# EAGLE design master_control_shield_v1 (EAGLE 5.11)
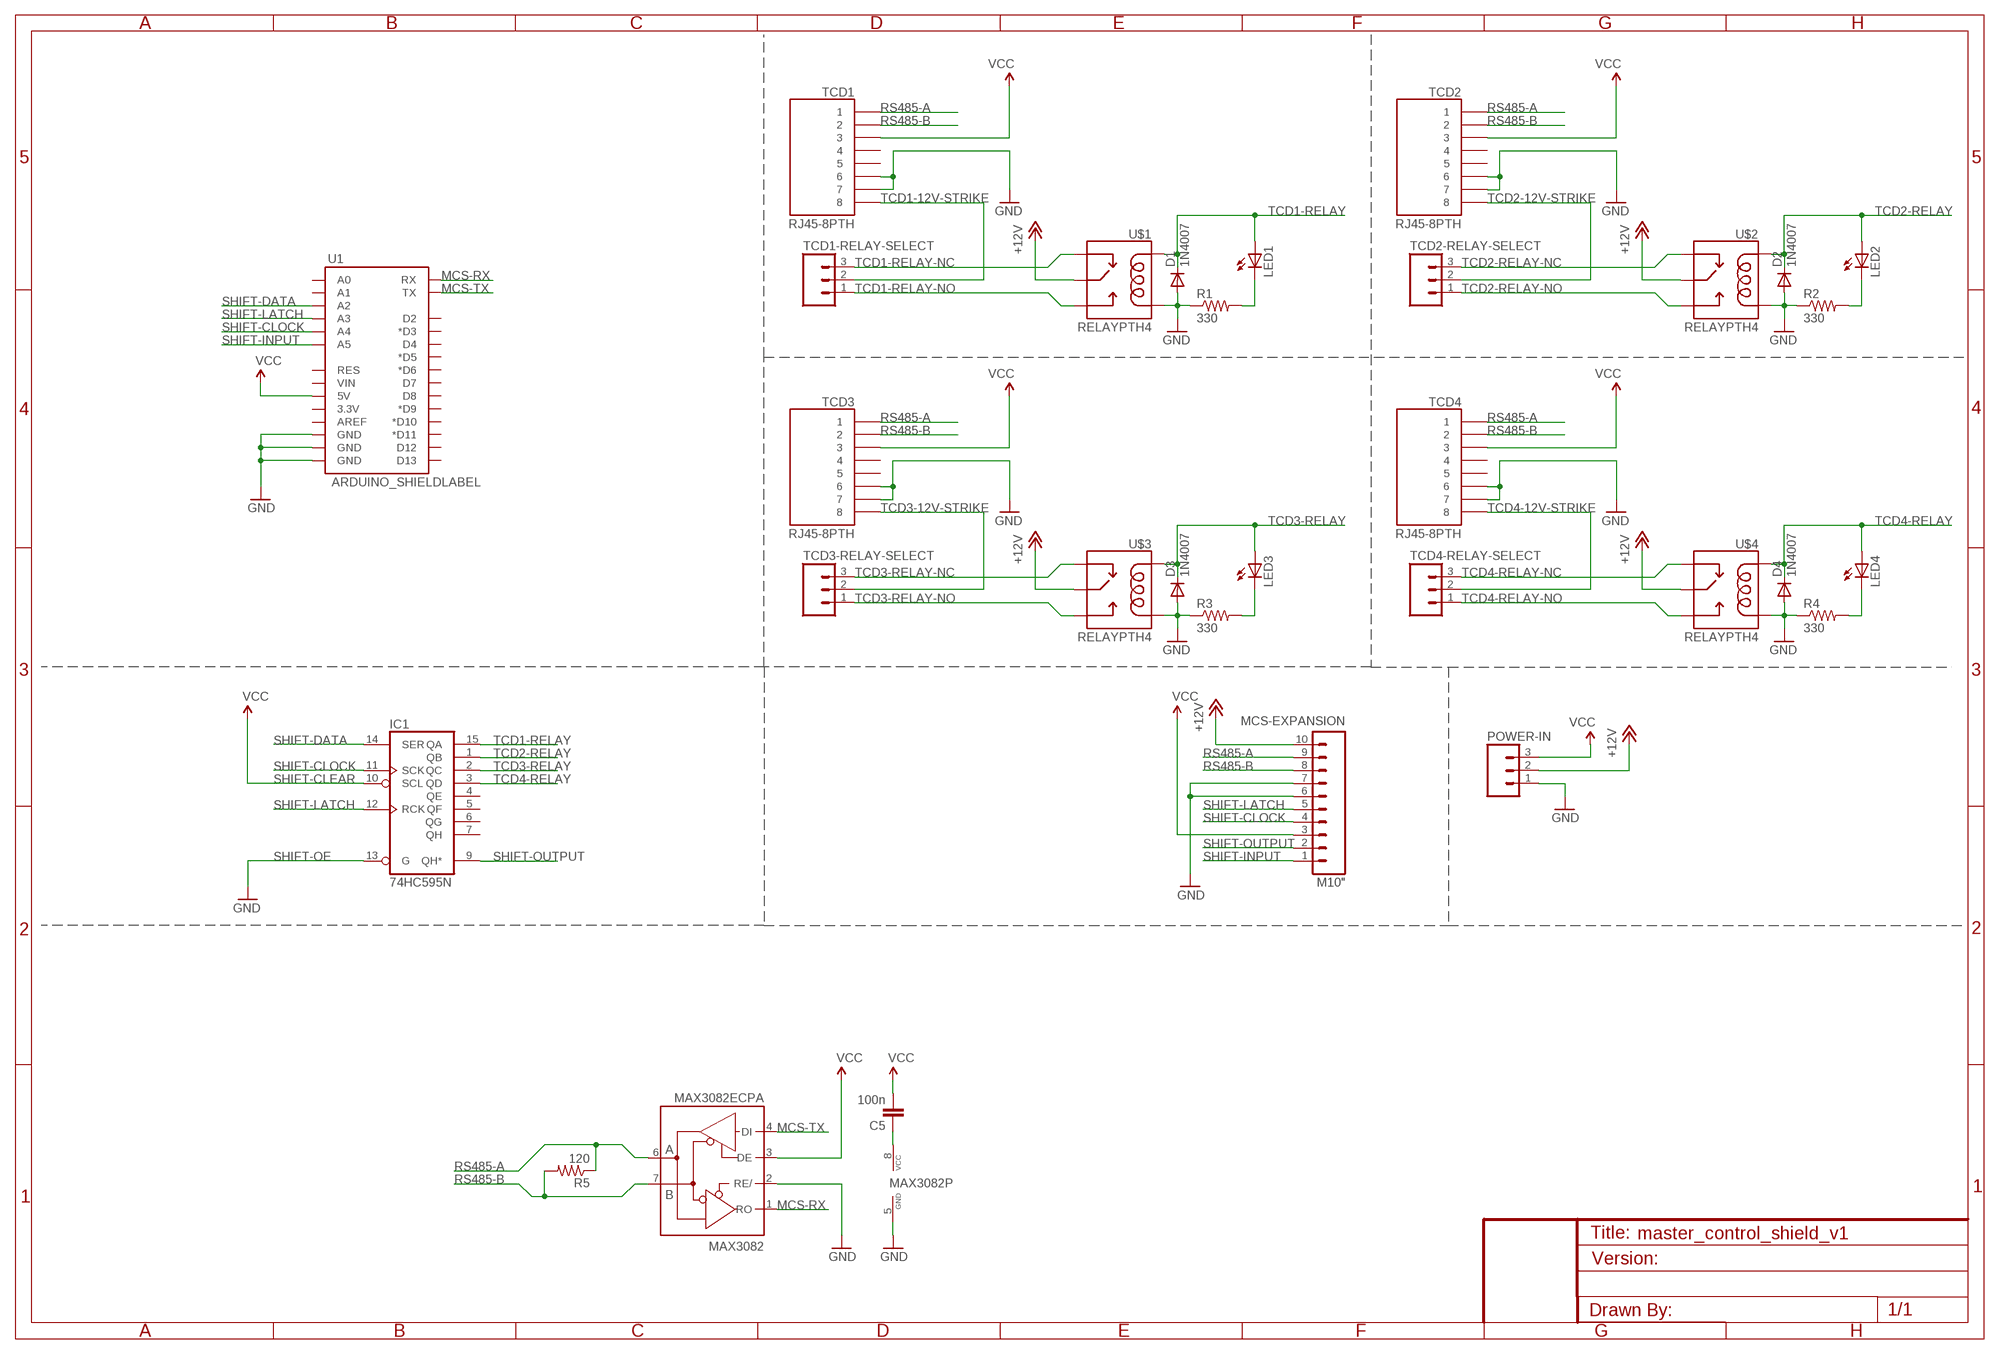
[diagram p0: schematic, sheet 1]

## Parts
C5  100n  CAPPTH  [CAP-PTH-SMALL]
D1  1N4007  DIODEPTH  [DIODE-1N4001]
D2  1N4007  DIODEPTH  [DIODE-1N4001]
D3  1N4007  DIODEPTH  [DIODE-1N4001]
D4  1N4007  DIODEPTH  [DIODE-1N4001]
IC1  74HC595N  74LS595N  [DIL16]
LED1  LED5MM  [LED5MM]
LED2  LED5MM  [LED5MM]
LED3  LED5MM  [LED5MM]
LED4  LED5MM  [LED5MM]
MAX3082  MAX3082ECPA  MAX481CPA  [DIL08]
MCS-EXPANSION  M10"  [1X10]
POWER-IN  M03SCREW  [SCREWTERMINAL-3.5MM-3]
R1  330  RESISTORPTH-1/4W  [AXIAL-0.4]
R2  330  RESISTORPTH-1/4W  [AXIAL-0.4]
R3  330  RESISTORPTH-1/4W  [AXIAL-0.4]
R4  330  RESISTORPTH-1/4W  [AXIAL-0.4]
R5  120  RESISTORPTH-1/4W  [AXIAL-0.4]
TCD1  RJ45-8PTH  [RJ45-8]
TCD1-RELAY-SELECT  M03PTH  [1X03]
TCD2  RJ45-8PTH  [RJ45-8]
TCD2-RELAY-SELECT  M03PTH  [1X03]
TCD3  RJ45-8PTH  [RJ45-8]
TCD3-RELAY-SELECT  M03PTH  [1X03]
TCD4  RJ45-8PTH  [RJ45-8]
TCD4-RELAY-SELECT  M03PTH  [1X03]
U1  ARDUINO_SHIELDLABEL  [DUEMILANOVE_SHIELD]
U$1  RELAYPTH4  [RELAY-JZC]
U$2  RELAYPTH4  [RELAY-JZC]
U$3  RELAYPTH4  [RELAY-JZC]
U$4  RELAYPTH4  [RELAY-JZC]

## Nets
+12V [signal]: MCS-EXPANSION.10 POWER-IN.2 U$1.4(MAIN) U$2.4(MAIN) U$3.4(MAIN) U$4.4(MAIN)
GND: D1.A D2.A D3.A D4.A IC1.13(G) MAX3082.2(RE/) MAX3082.5(GND) MCS-EXPANSION.6 MCS-EXPANSION.7 POWER-IN.1 R1.P$1 R2.P$1 R3.P$1 R4.P$1 TCD1.6 TCD1.7 TCD2.6 TCD2.7 TCD3.6 TCD3.7 TCD4.6 TCD4.7 U1.GND@0(GND) U1.GND@1(GND) U1.GND@2(GND) U$1.1(COIL2) U$2.1(COIL2) U$3.1(COIL2) U$4.1(COIL2)
MCS-RX: MAX3082.1(RO) U1.RX
MCS-TX: MAX3082.4(DI) U1.TX
N$1: LED1.K(C) R1.P$2
N$2: LED2.K(C) R2.P$2
N$3: LED3.K(C) R3.P$2
N$4: LED4.K(C) R4.P$2
N$14: C5.1 MAX3082.8(VCC)
RS485-A: MAX3082.6(A) MCS-EXPANSION.9 R5.P$1 TCD1.1 TCD2.1 TCD3.1 TCD4.1
RS485-B: MAX3082.7(B) MCS-EXPANSION.8 R5.P$2 TCD1.2 TCD2.2 TCD3.2 TCD4.2
SHIFT-CLOCK: IC1.11(SCK) MCS-EXPANSION.4 U1.A4
SHIFT-DATA: IC1.14(SER) U1.A2
SHIFT-INPUT: MCS-EXPANSION.1 U1.A5
SHIFT-LATCH: IC1.12(RCK) MCS-EXPANSION.5 U1.A3
SHIFT-OUTPUT: IC1.9(QH*) MCS-EXPANSION.2
TCD1-12V-STRIKE: TCD1-RELAY-SELECT.2 TCD1.8
TCD1-RELAY: D1.C IC1.15(QA) LED1.A U$1.5(COIL1)
TCD1-RELAY-NC: TCD1-RELAY-SELECT.3 U$1.2(NC)
TCD1-RELAY-NO: TCD1-RELAY-SELECT.1 U$1.3(NO)
TCD2-12V-STRIKE: TCD2-RELAY-SELECT.2 TCD2.8
TCD2-RELAY: D2.C IC1.1(QB) LED2.A U$2.5(COIL1)
TCD2-RELAY-NC: TCD2-RELAY-SELECT.3 U$2.2(NC)
TCD2-RELAY-NO: TCD2-RELAY-SELECT.1 U$2.3(NO)
TCD3-12V-STRIKE: TCD3-RELAY-SELECT.2 TCD3.8
TCD3-RELAY: D3.C IC1.2(QC) LED3.A U$3.5(COIL1)
TCD3-RELAY-NC: TCD3-RELAY-SELECT.3 U$3.2(NC)
TCD3-RELAY-NO: TCD3-RELAY-SELECT.1 U$3.3(NO)
TCD4-12V-STRIKE: TCD4-RELAY-SELECT.2 TCD4.8
TCD4-RELAY: D4.C IC1.3(QD) LED4.A U$4.5(COIL1)
TCD4-RELAY-NC: TCD4-RELAY-SELECT.3 U$4.2(NC)
TCD4-RELAY-NO: TCD4-RELAY-SELECT.1 U$4.3(NO)
VCC: C5.2 IC1.10(SCL) MAX3082.3(DE) MCS-EXPANSION.3 POWER-IN.3 TCD1.3 TCD2.3 TCD3.3 TCD4.3 U1.5V
Unconnected: IC1.4(QE) IC1.5(QF) IC1.6(QG) IC1.7(QH) TCD1.4 TCD1.5 TCD2.4 TCD2.5 TCD3.4 TCD3.5 TCD4.4 TCD4.5 U1.3.3V U1.A0 U1.A1 U1.AREF U1.D2 U1.D3(*D3) U1.D4 U1.D5(*D5) U1.D6(*D6) U1.D7 U1.D8 U1.D9(*D9) U1.D10(*D10) U1.D11(*D11) U1.D12 U1.D13 U1.RES U1.VIN

## Notes on the sheet
- SHIFT-CLEAR
- SHIFT-OE

## Power pins joined to a net without a drawn wire
GND: IC1.8(GND)
VCC: IC1.16(VCC)

## Library data of the parts
C5 = SparkFun:CAP: Capacitor Standard 0603 ceramic capacitor, and 0.1" leaded capacitor.
D1-D4 = SparkFun:DIODE: Diode These are standard reverse protection diodes and small signal diodes. SMA package can handle up to about 1A. SOD-323 can handle about 200mA. What the SOD-323 package when ordering, there are some mfgs out there that are 5-pin packages.
IC1 = 74xx-us:74*595: 8-bit SHIFT REGISTER, output latch
LED1-LED4 = SparkFun:LED: LEDs Standard schematic elements and footprints for 5mm, 3mm, 1206, and 0603 sized LEDs. 5mm - Spark Fun Electronics SKU : COM-00529 (and others)
MAX3082 = maxim:MAX481CPA: RS485 TRANSEIVER; MPN: MAX481CPA+; OC_FARNELL: unknown; OC_NEWARK: 99K3445
MCS-EXPANSION = SparkFun:M10: Header 10 Standard 10-pin 0.1" header. Use with straight break away headers (SKU : PRT-00116), right angle break away headers (PRT-00553), swiss pins (PRT-00743), machine pins (PRT-00117), and female headers (PRT-00115).
POWER-IN TCD1-RELAY-SELECT TCD2-RELAY-SELECT TCD3-RELAY-SELECT TCD4-RELAY-SELECT = SparkFun:M03: Header 3 Standard 3-pin 0.1" header. Use with straight break away headers (SKU : PRT-00116), right angle break away headers (PRT-00553), swiss pins (PRT-00743), machine pins (PRT-00117), and female headers (PRT-00115). Molex polarized connector foot print use with SKU : PRT-08232 with associated crimp pins and housings.
R1-R5 = SparkFun:RESISTOR: Resistor Basic schematic elements and footprints for 0603, 1206, and PTH resistors.
TCD1-TCD4 = SparkFun:RJ45-8: RJ45 Jack Simple RJ45, 8-pin connection - connector for common Cat5, Cat5e, and Cat6 Ethernet cables. Footprint not yet proven in production. Connector sku is PRT-00643; Breakout PCB sku is BOB-00716.
U1 = SparkFun:ARDUINO_SHIELD
U$1-U$4 = SparkFun:RELAY

## Net classes
1 power: width 0.61 mm, clearance 0.406 mm
2 signal: width 0.406 mm, clearance 0.305 mm
3 ground: width 0.406 mm, drill 0.127 mm, clearance 0.254 mm to class 0, clearance 0.254 mm to class 1, clearance 0.254 mm to class 2

## Board
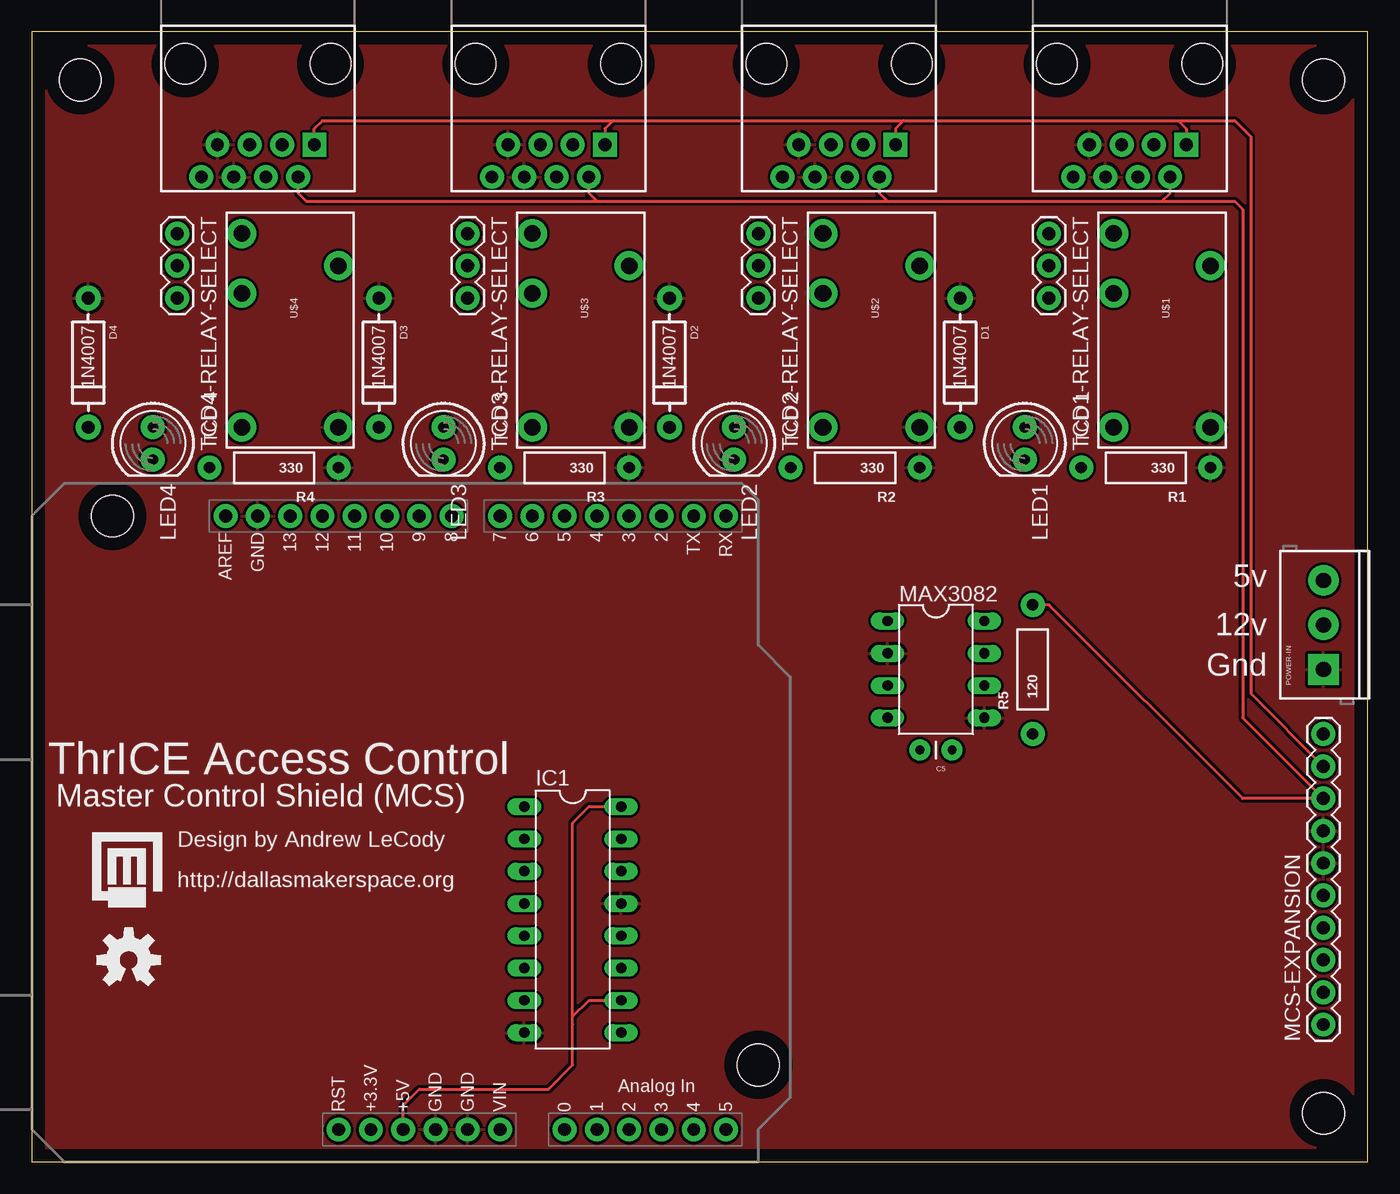
[diagram p1: board, top side]
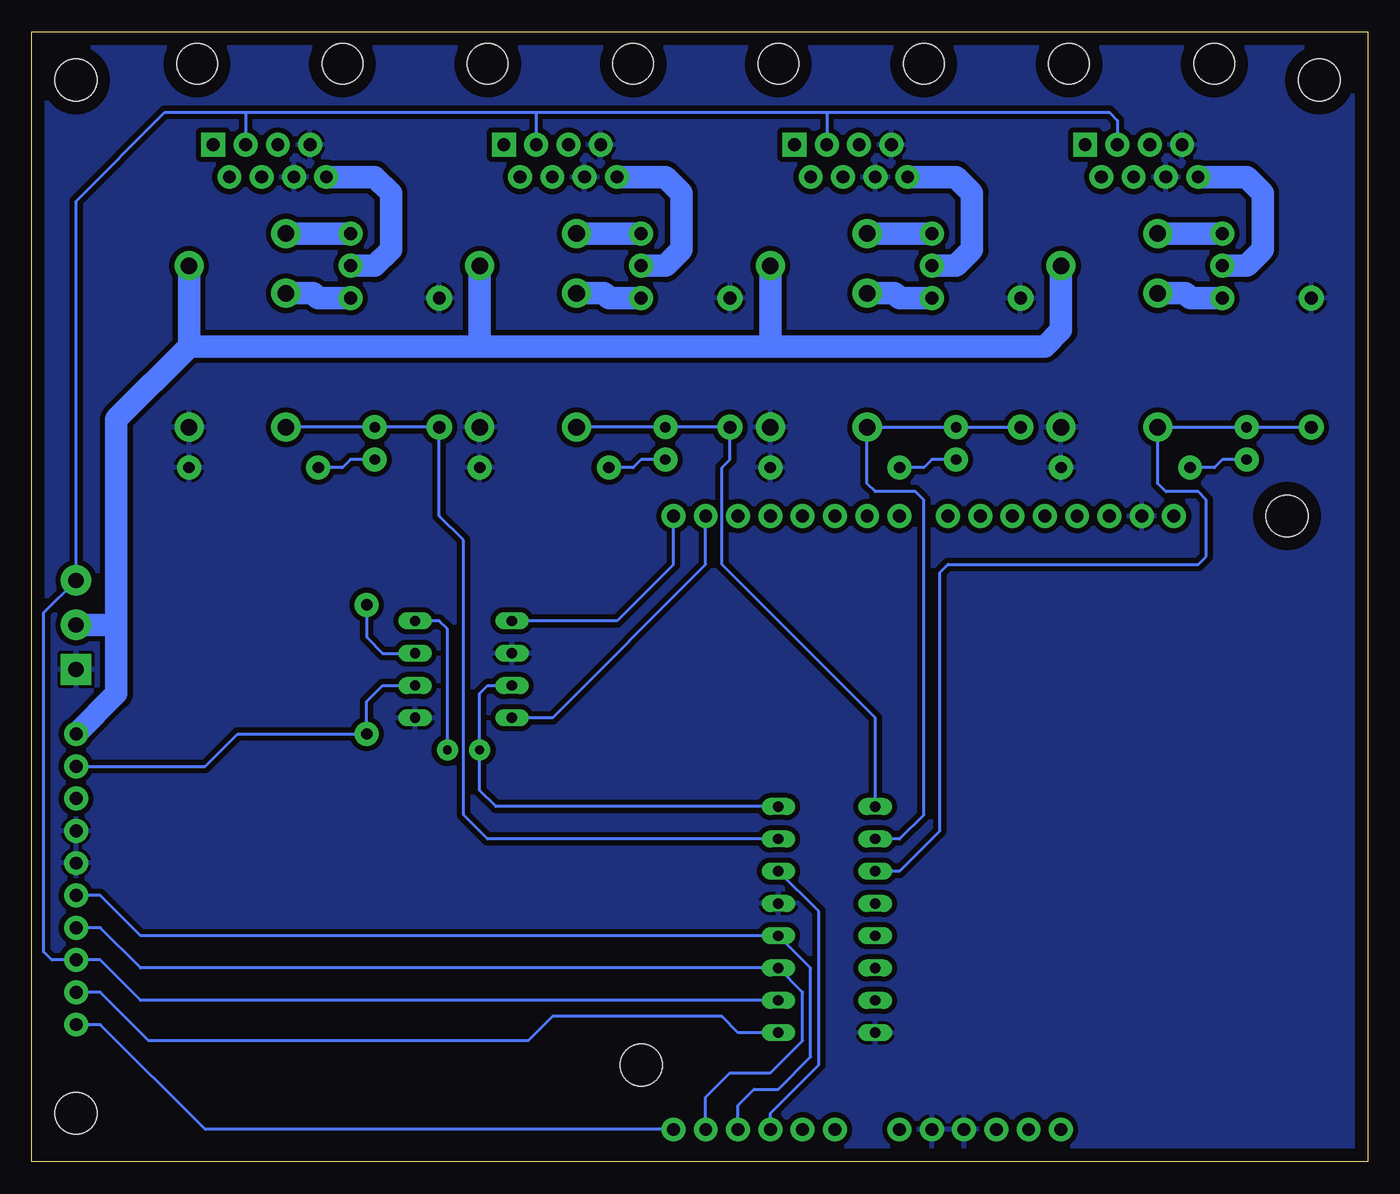
[diagram p2: board, bottom side, seen from below]

Size 105.08 x 88.89 mm. Coordinates in mm from the lower left corner, seen from the top.
Outline: 0,0 105.08,0 105.08,88.89 0,88.89 0,0
Copper layers (1*16): Top 0.035mm / dielectric 1.5mm / Bottom 0.035mm
Design rules "default": minimum track width 10mil, minimum drill 24mil, track to track 8mil, track to pad 8mil, pad to pad 8mil, via to via 8mil, smd to smd 8mil, copper to edge 40mil, drill to drill 8mil, minimum pad ring 10mil, minimum via ring 8mil, stop-mask expansion 4mil, vias tented up to drill 0mil, thermal gap 10mil

### Footprints (pad centres in the part's own frame; a part is rotated, then mirrored left to right if it is on the bottom)
CAP-PTH-SMALL = drill 0.7 pad 1.651 round: 1 0,0; 2 2.54,0
DIODE-1N4001 = drill 1 pad 1.981 round: A -5.08,0; C 5.08,0
DIL16 = drill 0.813 long: 1 -8.89,-3.81; 2 -6.35,-3.81; 3 -3.81,-3.81; 4 -1.27,-3.81; 5 1.27,-3.81; 6 3.81,-3.81; 7 6.35,-3.81; 8 8.89,-3.81; 9 8.89,3.81; 10 6.35,3.81; 11 3.81,3.81; 12 1.27,3.81; 13 -1.27,3.81; 14 -3.81,3.81; 15 -6.35,3.81; 16 -8.89,3.81
LED5MM = drill 0.813 pad 1.88 round: A -1.27,0; K 1.27,0
DIL08 = drill 0.813 long: 1 -3.81,-3.81; 2 -1.27,-3.81; 3 1.27,-3.81; 4 3.81,-3.81; 5 3.81,3.81; 6 1.27,3.81; 7 -1.27,3.81; 8 -3.81,3.81
1X10 = drill 1.016 pad 1.88 round: 1 0,0; 2 2.54,0; 3 5.08,0; 4 7.62,0; 5 10.16,0; 6 12.7,0; 7 15.24,0; 8 17.78,0; 9 20.32,0; 10 22.86,0
SCREWTERMINAL-3.5MM-3 = drill 1.2 pad 2.413 square: 1 0,0 | drill 1.2 pad 2.413 round: 2 3.5,0; 3 7,0
AXIAL-0.4 = drill 0.9 pad 1.88 round: P$1 -5.08,0; P$2 5.08,0
RJ45-8 = drill 1 pad 1.88 square: 1 -4.445,6.35 | drill 1 pad 1.88 round: 2 -3.175,8.89; 3 -1.905,6.35; 4 -0.635,8.89; 5 0.635,6.35; 6 1.905,8.89; 7 3.175,6.35; 8 4.445,8.89 | hole 3.2: -5.715,0; 5.715,0
1X03 = drill 1.016 pad 1.88 round: 1 0,0; 2 2.54,0; 3 5.08,0
DUEMILANOVE_SHIELD = drill 1.016 pad 1.88 round: 3.3V 50.8,26.67; 5V 50.8,29.21; A0 50.8,41.91; A1 50.8,44.45; A2 50.8,46.99; A3 50.8,49.53; A4 50.8,52.07; A5 50.8,54.61; AREF 2.54,15.24; D2 2.54,49.53; D3 2.54,46.99; D4 2.54,44.45; D5 2.54,41.91; D6 2.54,39.37; D7 2.54,36.83; D8 2.54,33.02; D9 2.54,30.48; D10 2.54,27.94; D11 2.54,25.4; D12 2.54,22.86; D13 2.54,20.32; GND@0 50.8,31.75; GND@1 50.8,34.29; GND@2 2.54,17.78; RES 50.8,24.13; RX 2.54,54.61; TX 2.54,52.07; VIN 50.8,36.83 | hole 3.302: 45.72,57.15; 2.54,6.35
RELAY-JZC = drill 1.3 pad 2.286 round: 1 3.81,-8.89; 2 -3.81,1.651; 3 -3.81,6.35; 4 3.81,3.81; 5 -3.81,-8.89
STAND-OFF = hole 3.302: 0,0

### Placement (x,y rotation side)
C5  72.39,32.38 180 top
D1  73.03,62.87 270 top
D2  50.16,62.87 270 top
D3  27.3,62.87 270 top
D4  4.45,62.87 270 top
IC1  42.55,19.05 270 top
LED1  78.11,56.51 270 top
LED2  55.24,56.51 270 top
LED3  32.38,56.51 270 top
LED4  9.53,56.51 270 top
MAX3082  71.12,38.73 270 top
MCS-EXPANSION  101.6,10.79 90 top
POWER-IN  101.6,38.73 90 top
R1  87.63,54.61 180 top
R2  64.77,54.61 180 top
R3  41.91,54.61 180 top
R4  19.05,54.61 180 top
R5  78.74,38.73 90 top
TCD1  86.36,86.36 180 top
TCD1-RELAY-SELECT  80.01,73.03 270 top
TCD2  63.5,86.36 180 top
TCD2-RELAY-SELECT  57.15,73.03 270 top
TCD3  40.64,86.36 180 top
TCD3-RELAY-SELECT  34.29,73.03 270 top
TCD4  17.78,86.36 180 top
TCD4-RELAY-SELECT  11.43,73.03 270 top
U1  0,53.34 270 top
U$1  88.9,66.67 0 top
U$2  66.04,66.67 0 top
U$3  43.18,66.67 0 top
U$4  20.32,66.67 0 top
U$5  [STAND-OFF]  3.81,85.09 0 top
U$6  [STAND-OFF]  101.6,85.09 0 top
U$7  [STAND-OFF]  101.6,3.81 0 top
U$8  [STAND-OFF]  6.35,50.8 0 top
U$9  [STAND-OFF]  57.15,7.62 0 top
U$10  [DMS-LOGO]  4.45,19.68 0 top
U$11  [OSHW-LOGO-M]  7.62,15.88 0 top

### Tracks (layer width: path | path; a pad name or v marks a point on that pad's centre or on a via)
+12V
  Bottom 1.778: 69.85,64.14 92.71,64.14 | 69.85,64.14 U$2.4 | 92.71,64.14 U$1.4 | 46.99,64.14 U$3.4 | 46.99,64.14 69.85,64.14 | 46.99,64.14 25.4,64.14 24.13,65.41 U$4.4 | MCS-EXPANSION.10 98.42,36.83 98.42,42.54 | 98.42,42.54 98.42,58.42 92.71,64.14 | POWER-IN.2 98.73,42.23 98.42,42.54
GND
  pour Bottom (isolate 0.406): -1.91,90.81 106.68,90.81 106.68,-1.91 -1.91,-1.91
  pour Top: -3.81,92.71 108.58,92.71 108.58,-3.81 -3.81,-3.81
MCS-RX
  Bottom 0.254: MAX3082.1 59.05,42.54 54.61,46.99 U1.RX
MCS-TX
  Bottom 0.254: U1.TX 52.07,46.99 64.14,34.92 MAX3082.4
N$1
  Bottom 0.254: R1.P$2 80.64,54.61 80.01,55.24 LED1.K
N$2
  Bottom 0.254: R2.P$2 57.78,54.61 57.15,55.24 LED2.K
N$3
  Bottom 0.254: R3.P$2 34.92,54.61 34.29,55.24 LED3.K
N$4
  Bottom 0.254: R4.P$2 12.06,54.61 11.43,55.24 LED4.K
N$14
  Bottom 0.254: MAX3082.8 73.03,42.54 72.39,41.91 C5.1
RS485-A
  Top 0.254: TCD1.1 90.81,81.28 90.17,81.92 | 45.72,81.92 22.86,81.92 22.23,81.28 TCD4.1 | 45.72,81.92 68.58,81.92 | 68.58,81.92 90.17,81.92 | TCD3.1 45.09,81.28 45.72,81.92 | TCD2.1 67.94,81.28 68.58,81.92 | 90.17,81.92 94.61,81.92 95.89,80.65 95.89,36.83 MCS-EXPANSION.9
  Bottom 0.254: MAX3082.6 77.47,37.46 78.74,36.2 R5.P$1 88.9,33.65 91.44,31.11 MCS-EXPANSION.9
RS485-B
  Top 0.254: TCD1.2 89.53,76.2 88.9,75.56 | 44.45,75.56 21.59,75.56 20.95,76.2 TCD4.2 | 44.45,75.56 67.31,75.56 | 67.31,75.56 88.9,75.56 | TCD3.2 43.81,76.2 44.45,75.56 | TCD2.2 66.67,76.2 67.31,75.56 | R5.P$2 80.01,43.81 95.25,28.57 MCS-EXPANSION.8 95.25,34.92 95.25,74.93 94.61,75.56 88.9,75.56
  Bottom 0.254: MAX3082.7 77.47,40 78.74,41.27 R5.P$2
SHIFT-CLOCK
  Bottom 0.254: MCS-EXPANSION.4 99.69,18.41 96.52,15.24 IC1.11 44.45,13.34 44.45,9.53 46.99,6.99 50.16,6.99 52.07,5.08 U1.A4
SHIFT-DATA
  Bottom 0.254: U1.A2 46.99,3.81 43.18,7.62 43.18,19.68 IC1.14
SHIFT-INPUT
  Bottom 0.254: MCS-EXPANSION.1 99.69,10.79 91.44,2.54 U1.A5
SHIFT-LATCH
  Bottom 0.254: MCS-EXPANSION.5 99.69,20.96 96.52,17.78 IC1.12 43.81,15.24 43.81,8.26 46.35,5.71 48.26,5.71 49.53,4.45 U1.A3
SHIFT-OUTPUT
  Bottom 0.254: MCS-EXPANSION.2 99.69,13.34 95.89,9.53 66.04,9.53 64.14,11.43 50.8,11.43 49.53,10.16 IC1.9
TCD1-12V-STRIKE
  Bottom 1.778: TCD1-RELAY-SELECT.2 78.11,70.48 76.83,71.76 76.83,76.2 78.11,77.47 TCD1.8
TCD1-RELAY
  Bottom 0.254: U$1.5 LED1.A D1.C 73.03,50.8 71.12,48.89 71.12,27.3 69.22,25.4 IC1.15
TCD1-RELAY-NC
  Bottom 1.778: U$1.2 82.93,68.33 82.55,67.95 TCD1-RELAY-SELECT.3
TCD1-RELAY-NO
  Bottom 1.778: TCD1-RELAY-SELECT.1 U$1.3
TCD2-12V-STRIKE
  Bottom 1.778: TCD2-RELAY-SELECT.2 55.24,70.48 53.98,71.76 53.98,76.2 55.24,77.47 TCD2.8
TCD2-RELAY
  Bottom 0.254: U$2.5 LED2.A D2.C 50.16,55.24 50.8,54.61 50.8,46.99 38.73,34.92 IC1.1
TCD2-RELAY-NC
  Bottom 1.778: U$2.2 60.07,68.33 59.69,67.95 TCD2-RELAY-SELECT.3
TCD2-RELAY-NO
  Bottom 1.778: TCD2-RELAY-SELECT.1 U$2.3
TCD3-12V-STRIKE
  Bottom 1.778: TCD3-RELAY-SELECT.2 32.38,70.48 31.11,71.76 31.11,76.2 32.38,77.47 TCD3.8
TCD3-RELAY
  Bottom 0.254: 38.73,57.78 LED3.A D3.C | 38.73,57.78 U$3.5 | IC1.2 36.83,25.4 34.92,27.3 34.92,52.07 35.56,52.7 38.73,52.7 39.37,53.34 39.37,57.15 38.73,57.78
TCD3-RELAY-NC
  Bottom 1.778: U$3.2 37.21,68.33 36.83,67.95 TCD3-RELAY-SELECT.3
TCD3-RELAY-NO
  Bottom 1.778: TCD3-RELAY-SELECT.1 U$3.3
TCD4-12V-STRIKE
  Bottom 1.778: TCD4-RELAY-SELECT.2 9.53,70.48 8.26,71.76 8.26,76.2 9.53,77.47 TCD4.8
TCD4-RELAY
  Bottom 0.254: D4.C LED4.A U$4.5 16.51,53.34 15.88,52.7 13.34,52.7 12.7,52.07 12.7,47.62 13.34,46.99 33.02,46.99 33.66,46.35 33.66,26.04 36.83,22.86 IC1.3
TCD4-RELAY-NC
  Bottom 1.778: U$4.2 14.35,68.33 13.97,67.95 TCD4-RELAY-SELECT.3
TCD4-RELAY-NO
  Bottom 1.778: TCD4-RELAY-SELECT.1 U$4.3
VCC
  Top 0.254: U1.5V 29.21,4.45 30.48,5.71 40.64,5.71 42.55,7.62 42.55,10.79 42.55,11.43 | 42.55,11.43 43.81,12.7 IC1.10 | IC1.16 43.81,27.94 42.55,26.67 42.55,11.43
  Bottom 0.254: IC1.10 96.52,12.7 99.69,15.88 MCS-EXPANSION.3 103.5,15.88 104.14,16.51 104.14,43.2 POWER-IN.3 101.6,75.56 94.61,82.55 88.27,82.55 | 45.72,27.94 IC1.16 68.58,27.94 69.85,29.21 C5.2 69.85,36.83 69.22,37.46 MAX3082.3 | 88.27,82.55 65.41,82.55 | 65.41,82.55 42.55,82.55 | 42.55,82.55 20.32,82.55 19.68,81.92 TCD4.3 | 42.55,82.55 TCD3.3 | 88.27,82.55 TCD1.3 | 65.41,82.55 TCD2.3

### Text on the board
tPlace: TCD 4 | TCD 3 | TCD 2 | TCD 1 | 5v | 12v | Gnd | ThrICE Access Control | Master Control Shield (MCS) | Design by Andrew LeCody | http://dallasmakerspace.org
200bmp: /home/aceat64/Downloads/DMS_Logo_Black.bmp